# EAGLE design New (EAGLE 6.1)
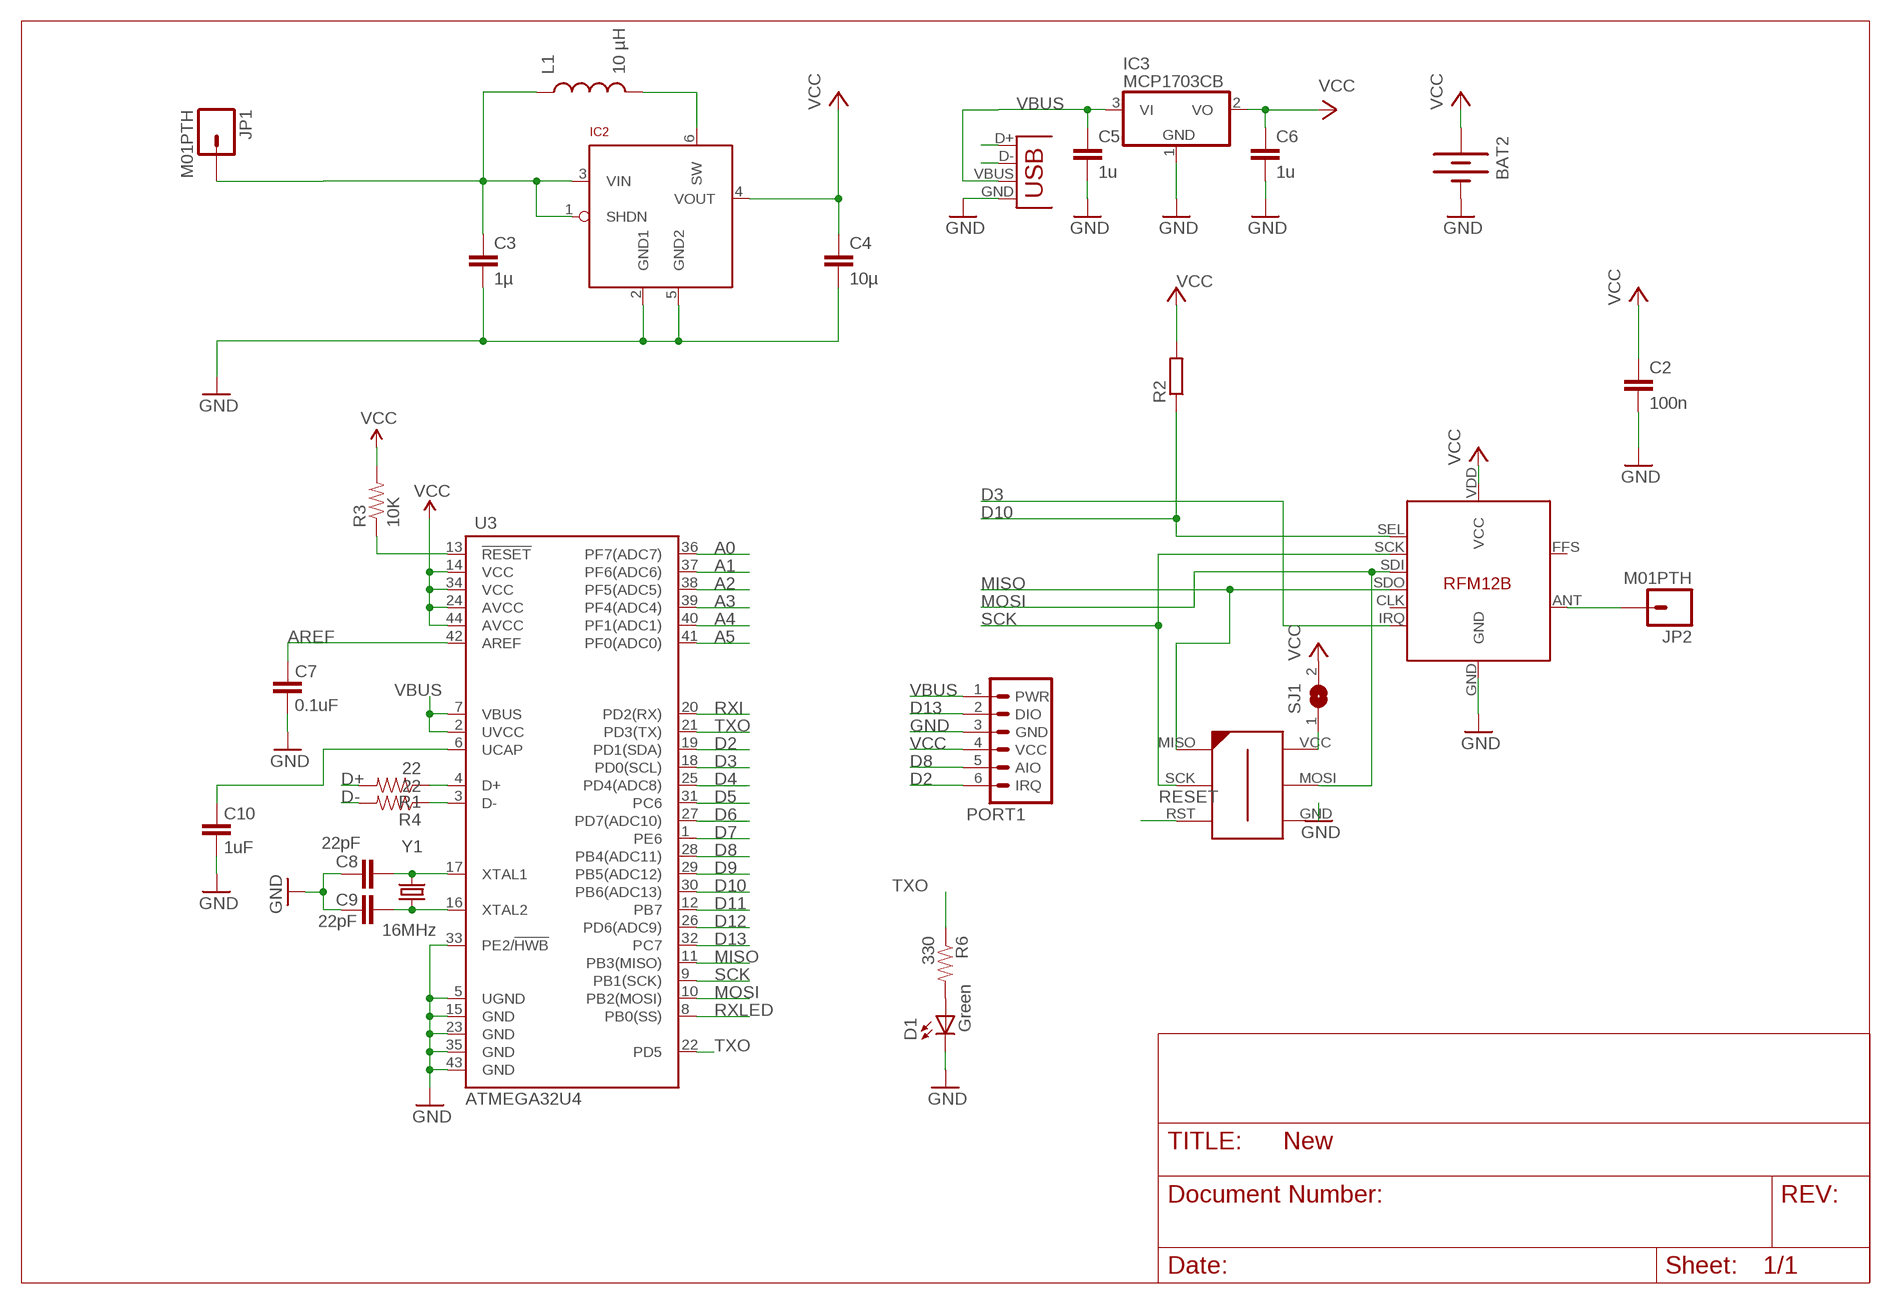
[diagram p0: schematic, sheet 1]

## Parts
BAT2  BATTERY20PTH  [BATTCOM_20MM_PTH]
C2  100n  C-EUC0603K  [C0603K]
C3  1µ  CAP0603-CAP  [0603-CAP]
C4  10µ  CAP0805  [0805]
C5  1u  C-EUC0603K  [C0603K]
C6  1u  C-EUC0603K  [C0603K]
C7  0.1uF  CAP0402-CAP  [0402-CAP]
C8  22pF  CAP0402-CAP  [0402-CAP]
C9  22pF  CAP0402-CAP  [0402-CAP]
C10  1uF  CAP0402-CAP  [0402-CAP]
D1  Green  LED0603  [LED-0603]
IC2  LTC3525  [SC70]
IC3  MCP1703CB  [SOT23]
JP1  M01PTH  [1X01]
JP2  M01PTH  [1X01]
L1  10 µH  INDUCTOR1210  [1210]
PORT1  JEEPORT-FEMALE  [1X06_FEMALE_LOCK.010]
R1  22  RESISTOR0402-RES  [0402-RES]
R2  R-EU_R0402  [R0402]
R3  10K  RESISTOR0402-RES  [0402-RES]
R4  22  RESISTOR0402-RES  [0402-RES]
R6  330  RESISTOR0402-RES  [0402-RES]
SJ1  SJ  [SJ]
U3  ATMEGA32U4  ATMEGA32U4QFN2  [QFN-44-NOPAD]
U$1  RFM12B  [RFM12B]
U$2  AVR-ISP-6-EDGE  [6PAD_ISP]
X1  USB-MICROB  [USB-MICROB]
Y1  16MHz  CRYSTAL5X3  [CRYSTAL-SMD-5X3]

## Nets
A0: U3.36(PF7(ADC7))
A1: U3.37(PF6(ADC6))
A2: U3.38(PF5(ADC5))
A3: U3.39(PF4(ADC4))
A4: U3.40(PF1(ADC1))
A5: U3.41(PF0(ADC0))
AREF: C7.2 U3.42(AREF)
D2: PORT1.6(IRQ) U3.19(PD1(SDA))
D3: U3.18(PD0(SCL)) U$1.IRQ
D4: U3.25(PD4(ADC8))
D5: U3.31(PC6)
D6: U3.27(PD7(ADC10))
D7: U3.1(PE6)
D8: PORT1.5(AIO) U3.28(PB4(ADC11))
D9: U3.29(PB5(ADC12))
D10: R2.1 U3.30(PB6(ADC13)) U$1.SEL
D11: U3.12(PB7)
D12: U3.26(PD6(ADC9))
D13: PORT1.2(DIO) U3.32(PC7)
D+: R1.2 X1.D+
D-: R4.2 X1.D-
GND: BAT2.2(-) C2.2 C3.2 C4.2 C5.2 C6.2 C7.1 C8.2 C9.2 C10.1 D1.C IC2.2(GND1) IC2.5(GND2) IC3.1(GND) PORT1.3(GND) U3.5(UGND) U3.15(GND) U3.23(GND) U3.33(PE2/!HWB) U3.35(GND) U3.43(GND) U$1.GND U$2.GND X1.GND
MISO: U3.11(PB3(MISO)) U$1.SDO U$2.MISO
MOSI: U3.10(PB2(MOSI)) U$1.SDI U$2.MOSI
N$1: C9.1 U3.16(XTAL2) Y1.1
N$2: R1.1 U3.4(D+)
N$3: JP2.1 U$1.ANT
N$4: C8.1 U3.17(XTAL1) Y1.3
N$5: C10.2 U3.6(UCAP)
N$6: D1.A R6.2
N$7: R4.1 U3.3(D-)
N$8: U3.22(PD5)
N$9: SJ1.1 U$2.VCC
N$13 [vcc]: IC2.6(SW) L1.2
RESET: R3.1 U3.13(!RESET) U$2.RST
RXI: U3.20(PD2(RX))
RXLED: U3.8(PB0(SS))
SCK: U3.9(PB1(SCK)) U$1.SCK U$2.SCK
TXO: R6.1 U3.21(PD3(TX))
VBUS: C5.1 IC3.3(VI) PORT1.1(PWR) U3.2(UVCC) U3.7(VBUS) X1.VBUS
VCC: BAT2.1(+) C2.1 C4.1 C6.1 IC2.4(VOUT) IC3.2(VO) PORT1.4(VCC) R2.2 R3.2 SJ1.2 U3.14(VCC) U3.24(AVCC) U3.34(VCC) U3.44(AVCC) U$1.VDD(VCC)
VIN: C3.1 IC2.1(SHDN) IC2.3(VIN) JP1.1 L1.1
Unconnected: U$1.CLK U$1.FFS

## Library data of the parts
BAT2 = SparkFun:BATTERY: Battery Holders Various common sizes : AA, AAA, 20mm coin cell and 12mm coin cell.
C2 C5 C6 = rcl:C-EU: CAPACITOR, European symbol
C3 C4 C7-C10 = SparkFun:CAP: Capacitor Standard 0603 ceramic capacitor, and 0.1" leaded capacitor.
D1 = SparkFun:LED: LEDs Standard schematic elements and footprints for 5mm, 3mm, 1206, and 0603 sized LEDs. 5mm - Spark Fun Electronics SKU : COM-00529 (and others)
IC2 = JeeLabs:LTC3525
IC3 = linear:MCP1703: 250 mA, 16V, Low Quiescent Current LDO Regulator Source: http://ww1.microchip.com/downloads/en/DeviceDoc/22049b.pdf
JP1 JP2 = SparkFun:M01: Header 1 Standard 1-pin 0.1" header. Use with straight break away headers (SKU : PRT-00116), right angle break away headers (PRT-00553), swiss pins (PRT-00743), machine pins (PRT-00117), and female headers (PRT-00115).
L1 = SparkFun:INDUCTOR: Inductors Basic Inductor/Choke - 0603 and 1206. Footprints are not proven and vary greatly between part numbers.
PORT1 = JeeParts:JEEPORT: PIN HEADER
R1 R3 R4 R6 = SparkFun:RESISTOR: Resistor Basic schematic elements and footprints for 0603, 1206, and PTH resistors.
R2 = resistor:R-EU_: RESISTOR, European symbol
SJ1 = jumper:SJ: SMD solder JUMPER
U3 = SparkFun:ATMEGA32U4
U$1 = JeeParts:RFM12B
U$2 = avr-7:AVR-ISP-6-EDGE: 6 pin edge connector for ISP with ATMEL MCUs. Developed by Craig Moates (craig at moates dot net). Library by David Blundell (blundar at gmail dot com). Often, even a 6 pin header is really inconvenient for board layout and/or production. This SMD-only header is our de-facto standard for using an edge connector for programming with the help of a 6pin/10pin to edge card adapter.
X1 = SparkFun:USB: USB Connectors USB-B-PTH is fully proven SKU : PRT-00139 USB-miniB is fully proven SKU : PRT-00587 USB-A-PCB is untested. USB-A-H is throughly reviewed, but untested. Spark Fun Electronics SKU : PRT-00437 USB-B-SMT is throughly reviewed, but untested. Needs silkscreen touching up. USB-A-S has not been used/tested USB-MB-H has not been used/tested
Y1 = SparkFun:CRYSTAL: Crystals Various standard crystals. Proven footprints. Spark Fun Electronics SKU : COM-00534

## Net classes
0 default: width 0.203 mm

## Board
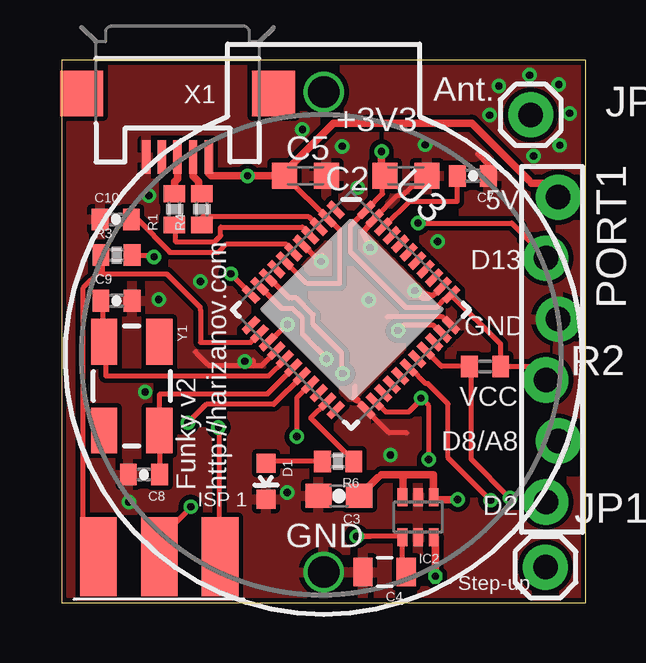
[diagram p1: board, top side]
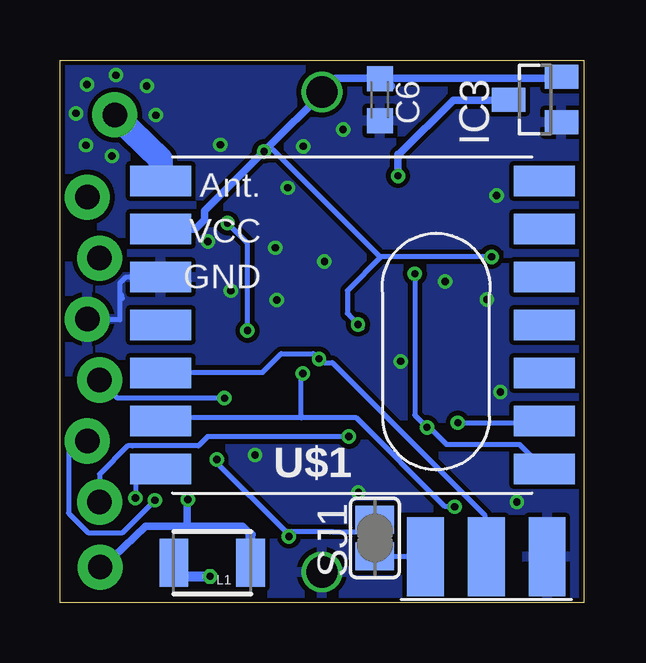
[diagram p2: board, bottom side, seen from below]

Size 21.84 x 22.61 mm. Coordinates in mm from the lower left corner, seen from the top.
Outline: 0,0 21.84,0 21.84,22.61 0,22.61 0,0
Copper layers (1*16): Top 0.035mm / dielectric 1.5mm / Bottom 0.035mm
Design rules: minimum track width 0.2mm, minimum drill 0.3mm, track to track 0.2mm, track to pad 0.2mm, pad to pad 0.2mm, via to via 0.2mm, smd to smd 0.2mm, copper to edge 0.2mm, drill to drill 0.2mm, minimum pad ring 0.2mm, minimum via ring 0.15mm, stop-mask expansion 0.075mm, vias tented up to drill 0.3mm, thermal gap 0.2mm
tRestrict: 5 lines
bRestrict: 2 lines

### Footprints (pad centres in the part's own frame; a part is rotated, then mirrored left to right if it is on the bottom)
BATTCOM_20MM_PTH = drill 1.3: 1 20,0; 2 0,0
C0603K = smd 1.05 x 1.08: 1 -0.875,0; 2 0.875,0
0603-CAP = smd 1.1 x 1: 1 -0.85,0; 2 0.85,0
0805 = smd 0.8 x 1.2: 1 -0.9,0; 2 0.9,0
0402-CAP = smd 0.7 x 0.9: 1 -0.65,0; 2 0.65,0
LED-0603 = smd 0.8 x 0.8: A 0,-0.75; C 0,0.75
SC70 = smd 0.4 x 0.75: 1 -0.65,-0.825; 2 0,-0.825; 3 0.65,-0.825; 4 0.65,0.825; 5 0,0.825; 6 -0.65,0.825
SOT23 = smd 1 x 1.4: 1 -0.95,-1.1; 2 0.95,-1.1; 3 0,1.1
1X01 = drill 1.016 pad 1.88: 1 0,0
1210 = smd 1.2 x 2: 1 -1.6,0; 2 1.6,0
1X06_FEMALE_LOCK.010 = drill 1.016 pad 1.88: 1 0,0.254; 2 2.54,-0.254; 3 5.08,0.254; 4 7.62,-0.254; 5 10.16,0.254; 6 12.7,-0.254
0402-RES = smd 0.7 x 0.9: 1 -0.65,0; 2 0.65,0
R0402 = smd 0.7 x 0.9: 1 -0.65,0; 2 0.65,0
SJ = smd 1.168 x 1.6: 1 -0.762,0; 2 0.762,0
QFN-44-NOPAD = smd 0.8 x 0.3: 1 -3.4,2.5; 2 -3.4,2; 3 -3.4,1.5; 4 -3.4,1; 5 -3.4,0.5; 6 -3.4,0; 7 -3.4,-0.5; 8 -3.4,-1; 9 -3.4,-1.5; 10 -3.4,-2; 11 -3.4,-2.5; 23 3.4,-2.5; 24 3.4,-2; 25 3.4,-1.5; 26 3.4,-1; 27 3.4,-0.5; 28 3.4,0; 29 3.4,0.5; 30 3.4,1; 31 3.4,1.5; 32 3.4,2; 33 3.4,2.5 | smd 0.3 x 0.8: 12 -2.5,-3.4; 13 -2,-3.4; 14 -1.5,-3.4; 15 -1,-3.4; 16 -0.5,-3.4; 17 0,-3.4; 18 0.5,-3.4; 19 1,-3.4; 20 1.5,-3.4; 21 2,-3.4; 22 2.5,-3.4; 34 2.5,3.4; 35 2,3.4; 36 1.5,3.4; 37 1,3.4; 38 0.5,3.4; 39 0,3.4; 40 -0.5,3.4; 41 -1,3.4; 42 -1.5,3.4; 43 -2,3.4; 44 -2.5,3.4
RFM12B = smd 2.54 x 1.27: ANT 8,-6; CLK -8,-2; FFS -8,2; GND 8,-2; IRQ -8,4; P$8 -8,0; P$10 -8,-4; P$12 -8,-6; P$16 8,0; SCK 8,4; SDI 8,2; SDO -8,6; SEL 8,6; VDD 8,-4
6PAD_ISP = smd 1.524 x 3.302 bottom: GND 2.54,0; MOSI 0,0; VCC -2.54,0 | smd 1.524 x 3.302: MISO -2.54,0; RST 2.54,0; SCK 0,0
USB-MICROB = smd 0.35 x 1.4: D+ 0,2.65; D- -0.65,2.65; GND 1.3,2.65; ID 0.65,2.65; VBUS -1.3,2.65 | smd 1.8 x 1.9: MT1 -4,0; MT2 4,0
CRYSTAL-SMD-5X3 = smd 1.9 x 1.1: 1 -1.85,-1.15; 2 1.85,-1.15; 3 1.85,1.15; 4 -1.85,1.15

### Placement (x,y rotation side)
BAT2  10.92,1.27 90 top
C2  14.35,17.78 0 top
C3  11.56,4.45 180 top
C4  13.46,1.27 180 top
C5  10.16,17.78 0 top
C6  8.51,20.96 270 bottom
C7  17.15,17.78 180 top
C8  3.43,5.33 180 top
C9  2.29,12.57 0 top
C10  2.26,15.96 0 top
D1  8.52,5.06 180 top
IC2  14.86,3.56 180 top
IC3  2.03,20.96 90 bottom
JP1  20.17,1.48 0 top
JP2  19.56,20.32 0 top
L1  15.49,1.65 180 bottom
PORT1  20.45,16.89 270 top
R1  4.7,16.38 90 top
R2  17.65,9.84 0 top
R3  2.29,14.48 0 top
R4  5.84,16.38 90 top
R6  11.53,5.88 180 top
SJ1  8.71,2.69 90 bottom
U3  12.06,12.19 315 top
U$1  9.65,11.56 180 bottom
U$2  4.06,1.9 180 top
X1  4.83,21.21 180 top
Y1  2.92,9.02 270 top

### Tracks (layer width: path | path; a pad name or v marks a point on that pad's centre or on a via)
A0
  Top 0.203: U3.36 15.53,13.62
AREF
  Top 0.203: 13.43,15.69 U3.42 13.48,15.69 14.49,16.7 16.48,16.7 16.48,17.69 C7.2 16.48,17.74
D2  (via drill 0.3)
  Top 0.203: 10.28,8.99 U3.19 9.8,8.51 v9.8,6.92
  Top 0.305: U3.19
  Bottom 0.203: v9.8,6.92 15.69,6.92 16.07,6.53 18.82,6.53 19.02,6.53 20.19,5.36 PORT1.6
D3  (via drill 0.3)
  Top 0.203: U3.18 | U3.18 8.84,8.26 6.02,8.26 v5.26,7.49
  Bottom 0.203: v5.26,7.49 1.72,7.49 U$1.IRQ
D4
  Top 0.203: 13.41,8.75 U3.25 13.33,8.79
D8  (via drill 0.3)
  Top 0.203: v17.88,4.26 16.11,6.04 16.11,8.27 15.95,8.43 15.63,8.76 15.27,9.12 15.18,9.12 14.55,9.75 U3.28
  Bottom 0.203: v17.88,4.26 19.23,2.91 20.67,2.91 21.48,3.72 21.48,6.69 20.76,6.69 PORT1.5
D10  (via drill 0.3)
  Top 0.203: U3.30 15.83,9.84 16.98,9.84 R2.1 17.07,9.75 17.07,5.97 v18.69,4.35
  Bottom 0.203: v18.69,4.35 18.69,5.52 17.7,5.52 U$1.SEL
D13  (via drill 0.3)
  Top 0.203: U3.32 15.85,11.2 15.49,11.56 14.25,11.56 v14.02,11.33 | v14.86,15.81 18.76,15.81 20.23,14.34 20.22,14.35 PORT1.2
  Bottom 0.203: v14.02,11.33 14.02,14.98 v14.86,15.81
D+
  Top 0.305: R1.2 4.7,17.53 4.83,17.65 X1.D+
D-
  Top 0.305: X1.D- 5.48,17.77 5.71,17.53 5.71,17.16 R4.2
GND  (via drill 0.3)
  Top 0.203: 12.36,8.39 12.7,8.05 U3.23 13.65,7.07 14.39,7.07 | 12.36,8.39 12.3,8.45 | v10.82,14.21 10.89,14.46 10.63,14.34 10.62,14.34 U3.5 | C7.1 17.8,18.25 17.35,18.69 | 13.07,16.01 U3.43 14.01,16.96 14.22,16.96 14.6,17.35 14.79,17.35 C2.2 | U3.15 8.33,9.86 7.98,9.86 | 7.98,9.86 6.23,9.86 6.13,9.89 5.63,10.39 5.58,10.44 | 5.59,10.45 5.58,10.44 | 5.58,10.44 | 15.49,12.8 v14.72,12.99 15.05,12.68 15.3,12.68 15.49,12.8 | 15.49,12.8 15.82,13.12 15.76,13.06 U3.35 | 15.49,12.8 15.88,13.12 | U3.33 15.88,11.91 15.5,11.91 13.58,11.91 | U3.35 | 15.94,13.25 15.94,13.24 U3.35 | 12.23,9.03 12.23,8.58 | 12.23,8.58 12.23,8.52 | 12.23,8.52 12.3,8.45 | 12.3,8.45 12.36,8.39 | 12.36,8.39 12.3,8.39 12.17,8.52 12.23,8.58 | 12.3,8.45 12.36,8.45 | 12.23,8.58 12.23,9.03 | 12.23,9.03 12.23,8.58 | 12.23,8.58 12.23,8.52 | 7.98,9.86 7.98,9.94 7.98,10.09 v7.64,10.05 | 14.88,4.39 IC2.2 14.88,4.39
  Top 0.254: 12.87,14.72 12.55,15.43 12.87,15.81 13.05,16 U3.43 12.86,15.81 12.81,15.81
  Bottom 0.203: PORT1.3 19.37,11.81 19.34,11.78 19.34,12.84 | 19.34,12.84 19.34,13.32 19.08,13.57 17.67,13.57 U$1.GND | 19.34,12.84 19.28,12.84 19.24,12.67 | C6.2 8.53,20.09 8.45,20.14
  other vias: 17.84,20.31 5.78,13.38 20.76,19.06 13.71,6.14 21.17,20.38 2.79,4.19 9.4,4.58 10.04,19.71 12.8,12.61 15.16,19.07 3.64,16.96 4.04,12.63 3.48,8.77 20.72,21.59 18.23,21.53 19.51,21.97 15.68,15.04 12.86,14.79 19.68,18.61 11.7,19.01 12.34,17.28
  pour Top: 0.25,22.48 21.59,22.48 21.59,0.13 0.25,0.13
  pour Bottom: 0.25,22.48 21.59,22.48 21.59,0.13 0.25,0.13
MISO  (via drill 0.3)
  Top 0.203: U3.11 7.89,12.86 v7.05,13.7 | v6.54,7.3 6.58,7.29 6.58,1.94 U$2.MISO
  Bottom 0.203: 1.67,5.57 U$1.SDO 1.73,5.64 2.68,6.59 5.73,6.59 6.38,7.24 v6.54,7.3 | v7.05,13.7 7.05,7.81 v6.54,7.3 | 6.48,7.24 v6.54,7.3
MOSI  (via drill 0.3)
  Top 0.203: 8.28,13.14 U3.10 | 8.28,13.09 U3.10 | 8.38,12.99 8.38,13.09 U3.10 | U3.10 8.43,12.99 9.18,12.24 9.28,12.24 9.63,12.24 10.03,11.84 10.03,11.19 10.65,10.58 | 11.03,10.19 10.65,10.58 | 11.03,10.19 v11.04,10.16 | 11.03,10.19 11.07,10.19 11.08,10.18 11.06,10.16 v11.04,10.16 | v11.04,10.16 11.04,10.14 11.02,10.12 11.02,10.21 10.65,10.58
  Bottom 0.203: U$1.SDI 17.63,9.59 13.4,9.59 12.62,10.37 11.27,10.37 11.09,10.19 | 11.09,10.19 11.02,10.12 | 4.1,1.86 4.1,1.94 4.08,1.94 U$2.MOSI 4.13,2.04 4.13,3.64 10.48,9.99 10.83,9.99 10.93,10.09 v11.04,10.16 11.08,10.19 11.09,10.19
N$1
  Top 0.203: 1.83,10.79 Y1.1 | U3.16 9.28,10.09 8.63,9.44 1.83,9.44 1.83,10.69 Y1.1 | C9.1 1.68,12.54 1.73,12.49 1.73,10.94 Y1.1
N$2
  Top 0.203: U3.4 10.33,15.34 10.03,15.64 6.63,15.64 6.63,15.29 6.38,15.04 4.73,15.04 4.73,15.69 R1.1
N$3
  Bottom 1.016: U$1.ANT 17.65,18.48 JP2.1
N$4
  Top 0.203: U3.17 9.63,9.74 8.58,8.69 4.08,8.69 4.08,7.19 Y1.3 4.08,7.09 C8.1
N$5
  Top 0.203: 9.66,14.67 U3.6 9.58,14.69 9.33,14.94 6.88,14.94 6.53,14.59 4.48,14.59 4.48,14.64 3.18,15.94 2.93,15.94 C10.2
N$6
  Top 0.203: R6.2 8.57,5.88 8.53,5.84 | 8.53,5.84 8.52,5.83 | 8.53,5.84 D1.A
N$7
  Top 0.203: U3.3 10.68,15.69 10.28,16.09 5.88,16.09 5.88,15.74 R4.1
N$9
  Bottom 0.203: SJ1.1 6.63,1.93 U$2.VCC
N$13  (via drill 0.3)
  Top 0.305: v15.58,1.09 15.58,2.69 IC2.6
  Bottom 0.305: 16.98,1.09 17.18,1.09 L1.2
  Bottom 0.406: 16.98,1.09 v15.58,1.09
RESET
  Top 0.203: 1.68,13.79 1.68,14.44 R3.1 | 1.68,13.79 1.68,13.69 4.38,13.69 5.78,12.29 5.78,12.19 5.78,10.84 7.78,10.84 7.88,10.84 U3.13 | U$2.RST 1.48,1.94 0.88,2.54 0.88,13.09 1.58,13.79 1.68,13.79
SCK  (via drill 0.3)
  Top 0.203: U3.9 8.62,13.54 | 4.08,1.94 U$2.SCK | 4.08,1.99 U$2.SCK | U3.9 8.58,13.59 8.58,13.57 | 8.68,13.49 U3.9 | 8.68,13.39 U3.9 | U3.9 8.73,13.44 9.48,12.69 9.58,12.69 9.78,12.69 10.48,11.99 10.48,11.59 11.68,10.39 11.68,9.54 v11.72,9.54 | v5.38,3.99 5.38,3.94 4.08,2.64 4.08,2.09 U$2.SCK
  Bottom 0.203: 17.53,7.69 17.63,7.59 U$1.SCK 17.48,7.69 11.78,7.69 | 11.78,7.69 9.48,7.69 5.78,3.99 v5.38,3.99 | v11.72,9.54 11.78,9.49 11.78,7.79 11.78,7.69
TXO
  Top 0.203: 12.23,5.76 12.17,5.83 12.18,5.83 R6.1 12.13,5.94 10.38,7.69 11.03,8.34 U3.21
VBUS  (via drill 0.3)
  Top 0.203: U3.2 9.42,17.67 9.4,17.67 C5.1 9.35,17.8 | 9.33,14.24 U3.7 9.33,14.19 10.23,13.29 11.58,13.29 11.58,15.54 11.13,15.99 | 11.13,15.94 U3.2 | 19.48,17.59 19.59,17.48 | 17.1,19.98 17.1,19.97 | 11.13,15.99 U3.2 | 11.13,15.99 U3.2
  Top 0.305: X1.VBUS 6.13,17.88 6.22,17.78 7.11,17.78 | 7.11,17.78 v7.75,17.78 | v7.75,17.78 9.27,17.78 | 9.27,17.78 C5.1 9.27,17.78 | v7.75,17.78 7.11,17.78 | PORT1.1 20.12,17.48 19.59,17.48 | 9.35,17.8 9.35,17.99 11.34,19.97 12.74,19.97 14.47,19.97 17.1,19.97 | 17.1,19.98 19.48,17.59
  Bottom 0.2: 3.18,20.69 IC3.3
  Bottom 0.305: v7.75,17.78 7.75,18.67 7.71,18.67 5.45,20.93 3.16,20.93 IC3.3
  Bottom 0.406: 3.18,20.69 3.17,20.7
VCC  (via drill 0.3)
  Top 0.203: PORT1.4 19.62,9.84 R2.2 18.3,10.76 U3.34 16.16,12.83 15.82,12.48 15.62,12.29 14.34,12.29 14.02,12.61 12.04,14.6 | 12.88,2.76 v12.3,2.76 14.15,2.76 14.18,2.73 IC2.4 14.18,2.69 14.18,1.29 C4.1 | 12.72,16.36 13.38,17.03 13.38,18.75 | 12.04,14.6 12.04,15.11 | 12.04,15.11 12.04,15.7 U3.44 | 8.56,10.85 U3.14 8.68,10.89 9.18,11.39 v9.42,11.59 | 12.04,14.6 12.04,15.11 | 13.01,8.44 U3.24 13.09,8.37 13.09,8.36 13.51,7.94 14.47,7.94 15.05,8.52 v14.98,8.52 15.3,8.2 v15.3,5.96 | R3.2 3.77,14.48 v3.85,14.4 | v13.34,18.8 13.38,18.76
  Top 0.305: C2.1 13.34,17.92 v13.34,18.8 13.38,18.75 | U3.44 12.72,16.36
  Bottom 0.2: IC3.2 0.98,21.89 0.98,21.84
  Bottom 0.203: 12.1,2.95 10.57,2.95 10.44,2.95 9.03,2.95 9.03,3.2 8.78,3.46 8.77,3.45 SJ1.2 | 12.1,2.95 v12.3,2.76 | v14.98,8.52 19.44,8.52 PORT1.4 | v3.85,14.4 8.46,14.4 | 8.46,14.4 9.86,13 9.86,12.04 9.78,11.99 9.23,11.44 v9.42,11.59 | 13.32,18.82 13.32,18.81 v13.34,18.8 | 12.1,2.95 12.42,2.95 15.37,5.89 v15.3,5.96 | 8.46,14.4 8.53,14.44 12.98,18.89 13.03,18.89 13.14,19
  Bottom 0.305: 8.51,21.84 10.35,21.84 BAT2.1 10.92,21.21 13.14,19 v13.34,18.8 | 8.49,21.84 2.41,21.84 0.98,21.84 | U$1.VDD 16.2,15.56 15.82,15.94 15.82,16.32 13.32,18.82
  Bottom 0.406: 8.08,21.52 C6.1 | 8.78,21.58 8.51,21.84 C6.1 | 8.44,21.65 8.51,21.72 8.49,21.73 8.49,21.84 C6.1 | 0.98,21.84 0.89,21.84 | 1.06,21.78 IC3.2
VIN  (via drill 0.3)
  Top 0.254: 15.51,5.32 15.49,5.33 | 14.22,5.33 14.22,4.49 | 14.22,4.49 14.22,4.45 14.22,4.49 | 13.34,5.33 13.21,5.21 13.17,5.21
  Top 0.305: 15.51,5.32 IC2.1 15.58,4.29 v16.51,4.29 | 15.49,5.33 14.22,5.33 | 14.22,5.33 14.22,4.49 14.18,4.49 IC2.3 | 14.22,5.33 13.34,5.33 | 13.17,5.21 C3.1
  Bottom 0.203: 16.53,4.29 v16.51,4.29 | 16.53,3.29 16.51,3.17 | 16.73,3.18 16.7,3.16 | JP1.1 20.18,1.39 20.08,1.44
  Bottom 0.305: 13.89,2.85 14.22,3.17 16.51,3.17 16.7,3.16 | 16.53,3.29 16.53,4.29 | 16.73,3.18 18.28,3.18 20.08,1.44
  Bottom 0.406: L1.1 13.89,2.85

### Text on the board
tPlace: Ant. | +3V3 | 5V | D13 | GND | VCC | D8/A8 | Funky v2 | ISP 1 | http://harizanov.com | GND | D2 | Step-up